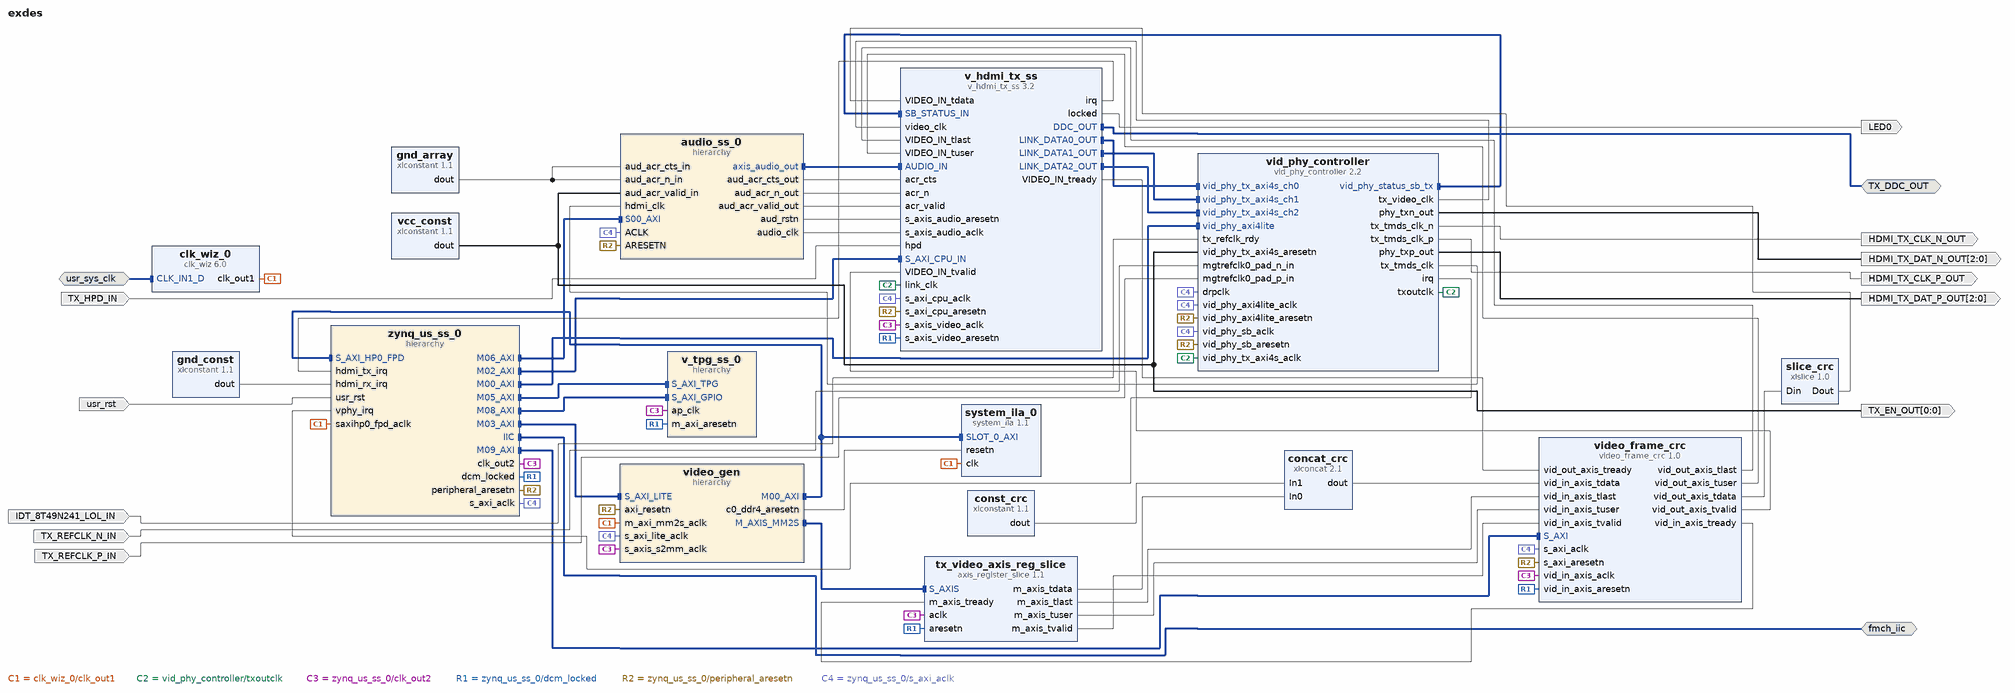
[diagram p0: block diagram of the top level]
# Vivado block design exdes, xczu7ev-ffvc1156-2-e, Vivado 2022.2
create_bd_design exdes

create_bd_intf_port -mode Master -vlnv xilinx.com:interface:iic_rtl:1.0 fmch_iic
create_bd_intf_port -mode Master -vlnv xilinx.com:interface:iic_rtl:1.0 TX_DDC_OUT
create_bd_intf_port -mode Slave -vlnv xilinx.com:interface:diff_clock_rtl:1.0 usr_sys_clk
set_property -dict {CONFIG.FREQ_HZ 300000000} [get_bd_intf_ports usr_sys_clk]
create_bd_port -dir I TX_HPD_IN
create_bd_port -dir I TX_REFCLK_P_IN
create_bd_port -dir I TX_REFCLK_N_IN
create_bd_port -dir O HDMI_TX_CLK_P_OUT
create_bd_port -dir O HDMI_TX_CLK_N_OUT
create_bd_port -dir O -from 2 -to 0 HDMI_TX_DAT_P_OUT
create_bd_port -dir O -from 2 -to 0 HDMI_TX_DAT_N_OUT
create_bd_port -dir O -from 0 -to 0 TX_EN_OUT
create_bd_port -dir I IDT_8T49N241_LOL_IN
create_bd_port -dir O LED0
create_bd_port -dir I -type rst usr_rst
set_property -dict {CONFIG.POLARITY ACTIVE_HIGH} [get_bd_ports usr_rst]

create_bd_cell -type ip -vlnv xilinx.com:ip:vid_phy_controller:2.2 vid_phy_controller
set_property -dict [list \
  CONFIG.CHANNEL_SITE X0Y16 \
  CONFIG.C_INPUT_PIXELS_PER_CLOCK 2 \
  CONFIG.C_INT_HDMI_VER_CMPTBLE 3 \
  CONFIG.C_RX_PLL_SELECTION 0 \
  CONFIG.C_RX_REFCLK_SEL 1 \
  CONFIG.C_Rx_Protocol None \
  CONFIG.C_TX_PLL_SELECTION 6 \
  CONFIG.C_TX_REFCLK_SEL 0 \
  CONFIG.C_Tx_Protocol HDMI \
  CONFIG.C_Txrefclk_Rdy_Invert true \
] [get_bd_cells vid_phy_controller]
create_bd_cell -type ip -vlnv xilinx.com:ip:xlconstant:1.1 vcc_const
set_property -dict {CONFIG.CONST_VAL 1} [get_bd_cells vcc_const]
create_bd_cell -type ip -vlnv xilinx.com:ip:xlconstant:1.1 gnd_const
set_property -dict {CONFIG.CONST_VAL 0} [get_bd_cells gnd_const]
create_bd_cell -type ip -vlnv xilinx.com:ip:axis_register_slice:1.1 tx_video_axis_reg_slice
set_property -dict {CONFIG.HAS_TLAST 1 CONFIG.TUSER_WIDTH 1} [get_bd_cells tx_video_axis_reg_slice]
create_bd_cell -type ip -vlnv xilinx.com:ip:v_hdmi_tx_ss:3.2 v_hdmi_tx_ss
set_property -dict [list \
  CONFIG.C_ADDR_WIDTH 10 \
  CONFIG.C_ADD_MARK_DBG 0 \
  CONFIG.C_EXDES_AXILITE_FREQ 100 \
  CONFIG.C_EXDES_RX_PLL_SELECTION 0 \
  CONFIG.C_EXDES_TOPOLOGY 1 \
  CONFIG.C_EXDES_TX_PLL_SELECTION 6 \
  CONFIG.C_HDMI_FAST_SWITCH true \
  CONFIG.C_HDMI_VERSION 3 \
  CONFIG.C_HPD_INVERT false \
  CONFIG.C_HYSTERESIS_LEVEL 12 \
  CONFIG.C_INCLUDE_HDCP_1_4 false \
  CONFIG.C_INCLUDE_HDCP_2_2 false \
  CONFIG.C_INCLUDE_LOW_RESO_VID true \
  CONFIG.C_INCLUDE_YUV420_SUP true \
  CONFIG.C_INPUT_PIXELS_PER_CLOCK 2 \
  CONFIG.C_MAX_BITS_PER_COMPONENT 8 \
  CONFIG.C_VALIDATION_ENABLE false \
  CONFIG.C_VIDEO_MASK_ENABLE 1 \
  CONFIG.C_VID_INTERFACE 0 \
] [get_bd_cells v_hdmi_tx_ss]
create_bd_cell -type ip -vlnv xilinx.com:ip:xlconstant:1.1 gnd_array
set_property -dict {CONFIG.CONST_VAL 0 CONFIG.CONST_WIDTH 20} [get_bd_cells gnd_array]
create_bd_cell -type ip -vlnv xilinx.com:ip:video_frame_crc:1.0 video_frame_crc
set_property -dict {CONFIG.BPC 8 CONFIG.Pixel_Per_Clock 2} [get_bd_cells video_frame_crc]
create_bd_cell -type ip -vlnv xilinx.com:ip:xlconstant:1.1 const_crc
set_property -dict {CONFIG.CONST_VAL 0 CONFIG.CONST_WIDTH 48} [get_bd_cells const_crc]
create_bd_cell -type ip -vlnv xilinx.com:ip:xlconcat:2.1 concat_crc
create_bd_cell -type ip -vlnv xilinx.com:ip:xlslice:1.0 slice_crc
set_property -dict {CONFIG.DIN_FROM 47 CONFIG.DIN_TO 0 CONFIG.DIN_WIDTH 96} [get_bd_cells slice_crc]
create_bd_cell -type hier v_tpg_ss_0
create_bd_cell -type hier audio_ss_0
create_bd_cell -type hier zynq_us_ss_0
create_bd_cell -type ip -vlnv xilinx.com:ip:system_ila:1.1 system_ila_0
create_bd_cell -type hier video_gen
create_bd_cell -type ip -vlnv xilinx.com:ip:clk_wiz:6.0 clk_wiz_0
set_property -dict [list \
  CONFIG.CLKIN1_JITTER_PS 33.330000000000005 \
  CONFIG.CLKOUT1_JITTER 97.190 \
  CONFIG.CLKOUT1_PHASE_ERROR 87.466 \
  CONFIG.CLKOUT1_REQUESTED_OUT_FREQ 250.000 \
  CONFIG.CLK_IN1_BOARD_INTERFACE clk_300mhz \
  CONFIG.MMCM_CLKFBOUT_MULT_F 11.875 \
  CONFIG.MMCM_CLKIN1_PERIOD 3.333 \
  CONFIG.MMCM_CLKIN2_PERIOD 10.0 \
  CONFIG.MMCM_CLKOUT0_DIVIDE_F 4.750 \
  CONFIG.MMCM_DIVCLK_DIVIDE 3 \
  CONFIG.PRIM_SOURCE Differential_clock_capable_pin \
  CONFIG.USE_LOCKED false \
  CONFIG.USE_RESET false \
] [get_bd_cells clk_wiz_0]

# ---- hierarchy /v_tpg_ss_0 ----
current_bd_instance /v_tpg_ss_0
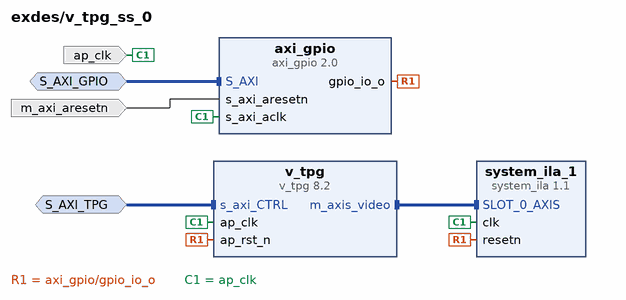
[diagram p1: block diagram inside /v_tpg_ss_0]
create_bd_intf_pin -mode Slave -vlnv xilinx.com:interface:aximm_rtl:1.0 S_AXI_TPG
create_bd_intf_pin -mode Slave -vlnv xilinx.com:interface:aximm_rtl:1.0 S_AXI_GPIO
create_bd_pin -dir I -type clk ap_clk
create_bd_pin -dir I -type rst m_axi_aresetn

create_bd_cell -type ip -vlnv xilinx.com:ip:v_tpg:8.2 v_tpg
set_property -dict [list \
  CONFIG.COLOR_SWEEP 0 \
  CONFIG.DISPLAY_PORT 0 \
  CONFIG.FOREGROUND 0 \
  CONFIG.HAS_AXI4S_SLAVE 0 \
  CONFIG.MAX_DATA_WIDTH 8 \
  CONFIG.RAMP 0 \
  CONFIG.SAMPLES_PER_CLOCK 2 \
  CONFIG.SOLID_COLOR 0 \
  CONFIG.ZONE_PLATE 0 \
] [get_bd_cells v_tpg]
create_bd_cell -type ip -vlnv xilinx.com:ip:axi_gpio:2.0 axi_gpio
set_property -dict {CONFIG.C_ALL_OUTPUTS 1 CONFIG.C_GPIO_WIDTH 1} [get_bd_cells axi_gpio]
create_bd_cell -type ip -vlnv xilinx.com:ip:system_ila:1.1 system_ila_1
set_property -dict {CONFIG.C_SLOT_0_INTF_TYPE xilinx.com:interface:axis_rtl:1.0} [get_bd_cells system_ila_1]

# ---- hierarchy /audio_ss_0 ----
current_bd_instance /audio_ss_0
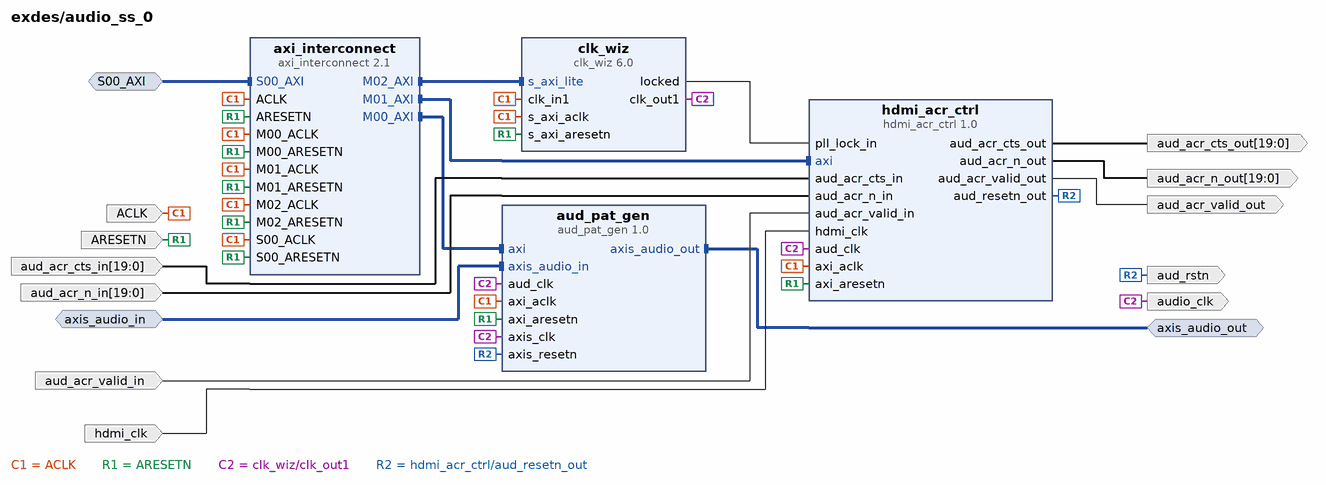
[diagram p2: block diagram inside /audio_ss_0]
create_bd_intf_pin -mode Slave -vlnv xilinx.com:interface:aximm_rtl:1.0 S00_AXI
create_bd_intf_pin -mode Slave -vlnv xilinx.com:interface:axis_rtl:1.0 axis_audio_in
create_bd_intf_pin -mode Master -vlnv xilinx.com:interface:axis_rtl:1.0 axis_audio_out
create_bd_pin -dir I -type clk ACLK
create_bd_pin -dir I -type rst ARESETN
create_bd_pin -dir I -type clk hdmi_clk
create_bd_pin -dir I -from 19 -to 0 aud_acr_cts_in
create_bd_pin -dir I -from 19 -to 0 aud_acr_n_in
create_bd_pin -dir I aud_acr_valid_in
create_bd_pin -dir O -from 19 -to 0 aud_acr_cts_out
create_bd_pin -dir O -from 19 -to 0 aud_acr_n_out
create_bd_pin -dir O aud_acr_valid_out
create_bd_pin -dir O -type rst aud_rstn
create_bd_pin -dir O -type clk audio_clk

create_bd_cell -type ip -vlnv xilinx.com:ip:axi_interconnect:2.1 axi_interconnect
set_property -dict {CONFIG.NUM_MI 3} [get_bd_cells axi_interconnect]
create_bd_cell -type ip -vlnv xilinx.com:ip:clk_wiz:6.0 clk_wiz
set_property -dict {CONFIG.PRIM_SOURCE No_buffer CONFIG.USE_DYN_RECONFIG true} [get_bd_cells clk_wiz]
create_bd_cell -type ip -vlnv xilinx.com:ip:aud_pat_gen:1.0 aud_pat_gen
create_bd_cell -type ip -vlnv xilinx.com:ip:hdmi_acr_ctrl:1.0 hdmi_acr_ctrl
set_property -dict {CONFIG.C_EXDES_TOPOLOGY 1 CONFIG.C_HDMI_VERSION 0} [get_bd_cells hdmi_acr_ctrl]

# ---- hierarchy /zynq_us_ss_0 ----
current_bd_instance /zynq_us_ss_0
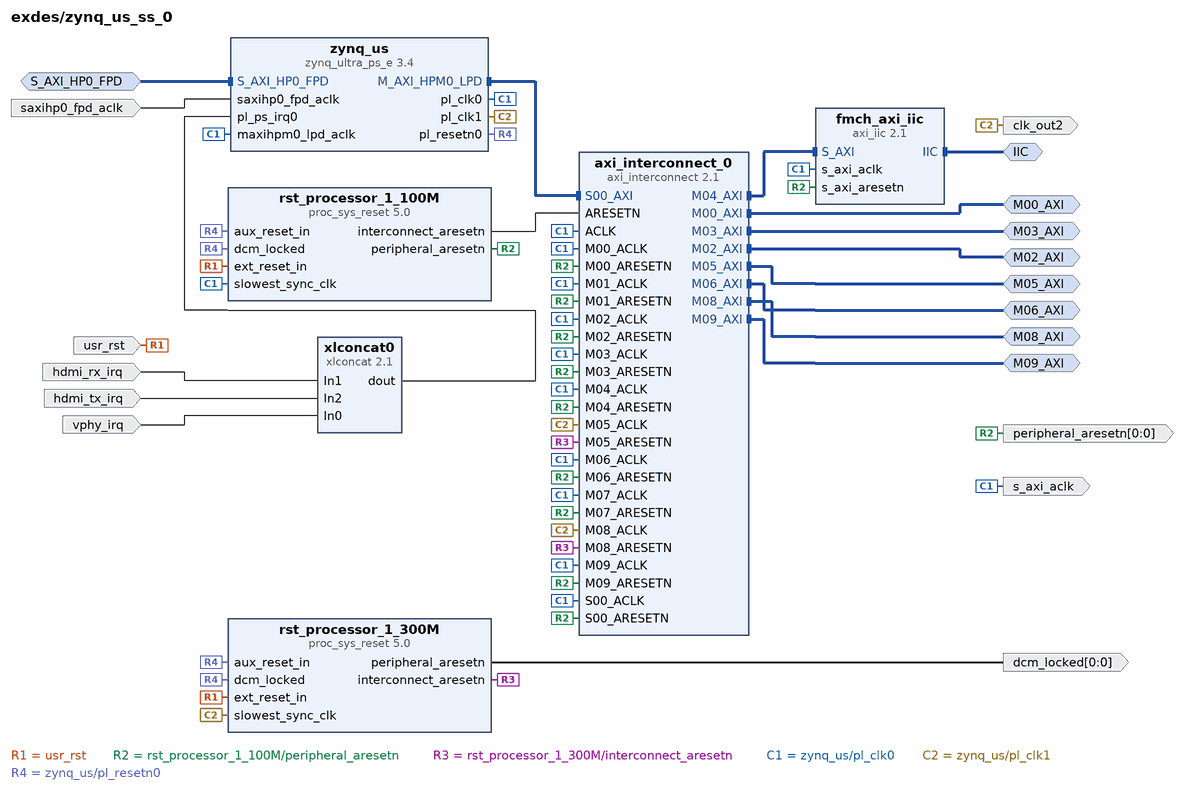
[diagram p3: block diagram inside /zynq_us_ss_0]
create_bd_intf_pin -mode Master -vlnv xilinx.com:interface:iic_rtl:1.0 IIC
create_bd_intf_pin -mode Master -vlnv xilinx.com:interface:aximm_rtl:1.0 M00_AXI
create_bd_intf_pin -mode Master -vlnv xilinx.com:interface:aximm_rtl:1.0 M02_AXI
create_bd_intf_pin -mode Master -vlnv xilinx.com:interface:aximm_rtl:1.0 M05_AXI
create_bd_intf_pin -mode Master -vlnv xilinx.com:interface:aximm_rtl:1.0 M06_AXI
create_bd_intf_pin -mode Master -vlnv xilinx.com:interface:aximm_rtl:1.0 M08_AXI
create_bd_intf_pin -mode Master -vlnv xilinx.com:interface:aximm_rtl:1.0 M09_AXI
create_bd_intf_pin -mode Master -vlnv xilinx.com:interface:aximm_rtl:1.0 M03_AXI
create_bd_intf_pin -mode Slave -vlnv xilinx.com:interface:aximm_rtl:1.0 S_AXI_HP0_FPD
create_bd_pin -dir I hdmi_rx_irq
create_bd_pin -dir I hdmi_tx_irq
create_bd_pin -dir I vphy_irq
create_bd_pin -dir O -type clk clk_out2
create_bd_pin -dir O -from 0 -to 0 dcm_locked
create_bd_pin -dir O -from 0 -to 0 -type rst peripheral_aresetn
create_bd_pin -dir O -type clk s_axi_aclk
create_bd_pin -dir I -type rst usr_rst
create_bd_pin -dir I -type clk saxihp0_fpd_aclk

create_bd_cell -type ip -vlnv xilinx.com:ip:axi_interconnect:2.1 axi_interconnect_0
set_property -dict {CONFIG.NUM_MI 10} [get_bd_cells axi_interconnect_0]
create_bd_cell -type ip -vlnv xilinx.com:ip:xlconcat:2.1 xlconcat0
set_property -dict {CONFIG.NUM_PORTS 3} [get_bd_cells xlconcat0]
create_bd_cell -type ip -vlnv xilinx.com:ip:zynq_ultra_ps_e:3.4 zynq_us
set_property -dict [list \
  CONFIG.PSU_BANK_0_IO_STANDARD LVCMOS18 \
  CONFIG.PSU_BANK_1_IO_STANDARD LVCMOS18 \
  CONFIG.PSU_BANK_2_IO_STANDARD LVCMOS18 \
  CONFIG.PSU_USB3__DUAL_CLOCK_ENABLE 1 \
  CONFIG.PSU__CAN1__PERIPHERAL__ENABLE 1 \
  CONFIG.PSU__CAN1__PERIPHERAL__IO {MIO 24 .. 25} \
  CONFIG.PSU__CRF_APB__ACPU_CTRL__FREQMHZ 1200 \
  CONFIG.PSU__CRF_APB__ACPU_CTRL__SRCSEL APLL \
  CONFIG.PSU__CRF_APB__APLL_CTRL__SRCSEL PSS_REF_CLK \
  CONFIG.PSU__CRF_APB__DBG_FPD_CTRL__FREQMHZ 250 \
  CONFIG.PSU__CRF_APB__DBG_FPD_CTRL__SRCSEL IOPLL \
  CONFIG.PSU__CRF_APB__DBG_TRACE_CTRL__FREQMHZ 250 \
  CONFIG.PSU__CRF_APB__DBG_TRACE_CTRL__SRCSEL IOPLL \
  CONFIG.PSU__CRF_APB__DBG_TSTMP_CTRL__FREQMHZ 250 \
  CONFIG.PSU__CRF_APB__DBG_TSTMP_CTRL__SRCSEL IOPLL \
  CONFIG.PSU__CRF_APB__DDR_CTRL__FREQMHZ 1067 \
  CONFIG.PSU__CRF_APB__DDR_CTRL__SRCSEL DPLL \
  CONFIG.PSU__CRF_APB__DPDMA_REF_CTRL__FREQMHZ 600 \
  CONFIG.PSU__CRF_APB__DPDMA_REF_CTRL__SRCSEL APLL \
  CONFIG.PSU__CRF_APB__DPLL_CTRL__SRCSEL PSS_REF_CLK \
  CONFIG.PSU__CRF_APB__DP_AUDIO_REF_CTRL__SRCSEL RPLL \
  CONFIG.PSU__CRF_APB__DP_STC_REF_CTRL__SRCSEL RPLL \
  CONFIG.PSU__CRF_APB__DP_VIDEO_REF_CTRL__SRCSEL VPLL \
  CONFIG.PSU__CRF_APB__GDMA_REF_CTRL__FREQMHZ 600 \
  CONFIG.PSU__CRF_APB__GDMA_REF_CTRL__SRCSEL APLL \
  CONFIG.PSU__CRF_APB__GPU_REF_CTRL__FREQMHZ 500 \
  CONFIG.PSU__CRF_APB__GPU_REF_CTRL__SRCSEL IOPLL \
  CONFIG.PSU__CRF_APB__TOPSW_LSBUS_CTRL__FREQMHZ 100 \
  CONFIG.PSU__CRF_APB__TOPSW_LSBUS_CTRL__SRCSEL IOPLL \
  CONFIG.PSU__CRF_APB__TOPSW_MAIN_CTRL__FREQMHZ 533.33 \
  CONFIG.PSU__CRF_APB__TOPSW_MAIN_CTRL__SRCSEL DPLL \
  CONFIG.PSU__CRF_APB__VPLL_CTRL__SRCSEL PSS_REF_CLK \
  CONFIG.PSU__CRL_APB__ADMA_REF_CTRL__FREQMHZ 500 \
  CONFIG.PSU__CRL_APB__ADMA_REF_CTRL__SRCSEL IOPLL \
  CONFIG.PSU__CRL_APB__CAN1_REF_CTRL__FREQMHZ 100 \
  CONFIG.PSU__CRL_APB__CAN1_REF_CTRL__SRCSEL IOPLL \
  CONFIG.PSU__CRL_APB__CPU_R5_CTRL__FREQMHZ 500 \
  CONFIG.PSU__CRL_APB__CPU_R5_CTRL__SRCSEL RPLL \
  CONFIG.PSU__CRL_APB__DBG_LPD_CTRL__FREQMHZ 250 \
  CONFIG.PSU__CRL_APB__DBG_LPD_CTRL__SRCSEL IOPLL \
  CONFIG.PSU__CRL_APB__GEM3_REF_CTRL__FREQMHZ 125 \
  CONFIG.PSU__CRL_APB__GEM3_REF_CTRL__SRCSEL IOPLL \
  CONFIG.PSU__CRL_APB__I2C0_REF_CTRL__FREQMHZ 100 \
  CONFIG.PSU__CRL_APB__I2C0_REF_CTRL__SRCSEL IOPLL \
  CONFIG.PSU__CRL_APB__I2C1_REF_CTRL__FREQMHZ 100 \
  CONFIG.PSU__CRL_APB__I2C1_REF_CTRL__SRCSEL IOPLL \
  CONFIG.PSU__CRL_APB__IOPLL_CTRL__SRCSEL PSS_REF_CLK \
  CONFIG.PSU__CRL_APB__IOU_SWITCH_CTRL__FREQMHZ 250 \
  CONFIG.PSU__CRL_APB__IOU_SWITCH_CTRL__SRCSEL IOPLL \
  CONFIG.PSU__CRL_APB__LPD_LSBUS_CTRL__FREQMHZ 100 \
  CONFIG.PSU__CRL_APB__LPD_LSBUS_CTRL__SRCSEL IOPLL \
  CONFIG.PSU__CRL_APB__LPD_SWITCH_CTRL__FREQMHZ 500 \
  CONFIG.PSU__CRL_APB__LPD_SWITCH_CTRL__SRCSEL IOPLL \
  CONFIG.PSU__CRL_APB__PCAP_CTRL__FREQMHZ 200 \
  CONFIG.PSU__CRL_APB__PCAP_CTRL__SRCSEL IOPLL \
  CONFIG.PSU__CRL_APB__PL0_REF_CTRL__FREQMHZ 100 \
  CONFIG.PSU__CRL_APB__PL0_REF_CTRL__SRCSEL RPLL \
  CONFIG.PSU__CRL_APB__PL1_REF_CTRL__FREQMHZ 300 \
  CONFIG.PSU__CRL_APB__QSPI_REF_CTRL__FREQMHZ 125 \
  CONFIG.PSU__CRL_APB__QSPI_REF_CTRL__SRCSEL IOPLL \
  CONFIG.PSU__CRL_APB__RPLL_CTRL__SRCSEL PSS_REF_CLK \
  CONFIG.PSU__CRL_APB__SDIO1_REF_CTRL__FREQMHZ 200 \
  CONFIG.PSU__CRL_APB__SDIO1_REF_CTRL__SRCSEL IOPLL \
  CONFIG.PSU__CRL_APB__TIMESTAMP_REF_CTRL__FREQMHZ 100 \
  CONFIG.PSU__CRL_APB__TIMESTAMP_REF_CTRL__SRCSEL IOPLL \
  CONFIG.PSU__CRL_APB__UART0_REF_CTRL__FREQMHZ 100 \
  CONFIG.PSU__CRL_APB__UART0_REF_CTRL__SRCSEL IOPLL \
  CONFIG.PSU__CRL_APB__UART1_REF_CTRL__FREQMHZ 100 \
  CONFIG.PSU__CRL_APB__UART1_REF_CTRL__SRCSEL IOPLL \
  CONFIG.PSU__CRL_APB__USB0_BUS_REF_CTRL__FREQMHZ 250 \
  CONFIG.PSU__CRL_APB__USB0_BUS_REF_CTRL__SRCSEL IOPLL \
  CONFIG.PSU__CRL_APB__USB3_DUAL_REF_CTRL__FREQMHZ 20 \
  CONFIG.PSU__CRL_APB__USB3_DUAL_REF_CTRL__SRCSEL IOPLL \
  CONFIG.PSU__CRL_APB__USB3__ENABLE 1 \
  CONFIG.PSU__DDRC__BUS_WIDTH {64 Bit} \
  CONFIG.PSU__DDRC__COMPONENTS UDIMM \
  CONFIG.PSU__DDRC__DEVICE_CAPACITY {4096 MBits} \
  CONFIG.PSU__DDRC__DRAM_WIDTH {16 Bits} \
  CONFIG.PSU__DDRC__ECC Disabled \
  CONFIG.PSU__DDRC__MEMORY_TYPE {DDR 4} \
  CONFIG.PSU__DDRC__SPEED_BIN DDR4_2133P \
  CONFIG.PSU__DDR_HIGH_ADDRESS_GUI_ENABLE 0 \
  CONFIG.PSU__DDR__INTERFACE__FREQMHZ 533.500 \
  CONFIG.PSU__DISPLAYPORT__LANE0__ENABLE 1 \
  CONFIG.PSU__DISPLAYPORT__LANE0__IO {GT Lane1} \
  CONFIG.PSU__DISPLAYPORT__LANE1__ENABLE 1 \
  CONFIG.PSU__DISPLAYPORT__LANE1__IO {GT Lane0} \
  CONFIG.PSU__DISPLAYPORT__PERIPHERAL__ENABLE 1 \
  CONFIG.PSU__DLL__ISUSED 1 \
  CONFIG.PSU__DPAUX__PERIPHERAL__ENABLE 1 \
  CONFIG.PSU__DPAUX__PERIPHERAL__IO {MIO 27 .. 30} \
  CONFIG.PSU__DP__LANE_SEL {Dual Lower} \
  CONFIG.PSU__DP__REF_CLK_FREQ 27 \
  CONFIG.PSU__DP__REF_CLK_SEL {Ref Clk3} \
  CONFIG.PSU__ENET3__FIFO__ENABLE 0 \
  CONFIG.PSU__ENET3__GRP_MDIO__ENABLE 1 \
  CONFIG.PSU__ENET3__GRP_MDIO__IO {MIO 76 .. 77} \
  CONFIG.PSU__ENET3__PERIPHERAL__ENABLE 1 \
  CONFIG.PSU__ENET3__PERIPHERAL__IO {MIO 64 .. 75} \
  CONFIG.PSU__ENET3__PTP__ENABLE 0 \
  CONFIG.PSU__ENET3__TSU__ENABLE 0 \
  CONFIG.PSU__FPGA_PL0_ENABLE 1 \
  CONFIG.PSU__FPGA_PL1_ENABLE 1 \
  CONFIG.PSU__GEM3_COHERENCY 0 \
  CONFIG.PSU__GEM3_ROUTE_THROUGH_FPD 0 \
  CONFIG.PSU__GEM__TSU__ENABLE 0 \
  CONFIG.PSU__GPIO0_MIO__IO {MIO 0 .. 25} \
  CONFIG.PSU__GPIO0_MIO__PERIPHERAL__ENABLE 1 \
  CONFIG.PSU__GPIO1_MIO__IO {MIO 26 .. 51} \
  CONFIG.PSU__GPIO1_MIO__PERIPHERAL__ENABLE 1 \
  CONFIG.PSU__GPIO_EMIO_WIDTH 95 \
  CONFIG.PSU__GPIO_EMIO__PERIPHERAL__ENABLE 1 \
  CONFIG.PSU__GPIO_EMIO__PERIPHERAL__IO 95 \
  CONFIG.PSU__GT__LINK_SPEED HBR \
  CONFIG.PSU__GT__PRE_EMPH_LVL_4 0 \
  CONFIG.PSU__GT__VLT_SWNG_LVL_4 0 \
  CONFIG.PSU__I2C0__PERIPHERAL__ENABLE 1 \
  CONFIG.PSU__I2C0__PERIPHERAL__IO {MIO 14 .. 15} \
  CONFIG.PSU__I2C1__PERIPHERAL__ENABLE 1 \
  CONFIG.PSU__I2C1__PERIPHERAL__IO {MIO 16 .. 17} \
  CONFIG.PSU__IOU_SLCR__IOU_TTC_APB_CLK__TTC0_SEL APB \
  CONFIG.PSU__IOU_SLCR__IOU_TTC_APB_CLK__TTC1_SEL APB \
  CONFIG.PSU__IOU_SLCR__IOU_TTC_APB_CLK__TTC2_SEL APB \
  CONFIG.PSU__IOU_SLCR__IOU_TTC_APB_CLK__TTC3_SEL APB \
  CONFIG.PSU__OVERRIDE__BASIC_CLOCK 0 \
  CONFIG.PSU__PRESET_APPLIED 1 \
  CONFIG.PSU__PSS_REF_CLK__FREQMHZ 33.333333 \
  CONFIG.PSU__QSPI_COHERENCY 0 \
  CONFIG.PSU__QSPI_ROUTE_THROUGH_FPD 0 \
  CONFIG.PSU__QSPI__GRP_FBCLK__ENABLE 1 \
  CONFIG.PSU__QSPI__GRP_FBCLK__IO {MIO 6} \
  CONFIG.PSU__QSPI__PERIPHERAL__DATA_MODE x4 \
  CONFIG.PSU__QSPI__PERIPHERAL__ENABLE 1 \
  CONFIG.PSU__QSPI__PERIPHERAL__IO {MIO 0 .. 5} \
  CONFIG.PSU__QSPI__PERIPHERAL__MODE Single \
  CONFIG.PSU__SATA__LANE1__IO {GT Lane3} \
  CONFIG.PSU__SATA__PERIPHERAL__ENABLE 1 \
  CONFIG.PSU__SATA__REF_CLK_FREQ 125 \
  CONFIG.PSU__SATA__REF_CLK_SEL {Ref Clk1} \
  CONFIG.PSU__SAXIGP2__DATA_WIDTH 64 \
  CONFIG.PSU__SD1_COHERENCY 0 \
  CONFIG.PSU__SD1_ROUTE_THROUGH_FPD 0 \
  CONFIG.PSU__SD1__CLK_50_SDR_ITAP_DLY 0x15 \
  CONFIG.PSU__SD1__CLK_50_SDR_OTAP_DLY 0x5 \
  CONFIG.PSU__SD1__DATA_TRANSFER_MODE 4Bit \
  CONFIG.PSU__SD1__GRP_CD__ENABLE 1 \
  CONFIG.PSU__SD1__GRP_CD__IO {MIO 45} \
  CONFIG.PSU__SD1__GRP_POW__ENABLE 0 \
  CONFIG.PSU__SD1__GRP_WP__ENABLE 0 \
  CONFIG.PSU__SD1__PERIPHERAL__ENABLE 1 \
  CONFIG.PSU__SD1__PERIPHERAL__IO {MIO 46 .. 51} \
  CONFIG.PSU__SD1__SLOT_TYPE {SD 2.0} \
  CONFIG.PSU__SWDT0__CLOCK__ENABLE 0 \
  CONFIG.PSU__SWDT0__PERIPHERAL__ENABLE 1 \
  CONFIG.PSU__SWDT0__RESET__ENABLE 0 \
  CONFIG.PSU__SWDT1__CLOCK__ENABLE 0 \
  CONFIG.PSU__SWDT1__PERIPHERAL__ENABLE 1 \
  CONFIG.PSU__SWDT1__RESET__ENABLE 0 \
  CONFIG.PSU__TSU__BUFG_PORT_PAIR 0 \
  CONFIG.PSU__TTC0__CLOCK__ENABLE 0 \
  CONFIG.PSU__TTC0__PERIPHERAL__ENABLE 1 \
  CONFIG.PSU__TTC0__WAVEOUT__ENABLE 0 \
  CONFIG.PSU__TTC1__CLOCK__ENABLE 0 \
  CONFIG.PSU__TTC1__PERIPHERAL__ENABLE 1 \
  CONFIG.PSU__TTC1__WAVEOUT__ENABLE 0 \
  CONFIG.PSU__TTC2__CLOCK__ENABLE 0 \
  CONFIG.PSU__TTC2__PERIPHERAL__ENABLE 1 \
  CONFIG.PSU__TTC2__WAVEOUT__ENABLE 0 \
  CONFIG.PSU__TTC3__CLOCK__ENABLE 0 \
  CONFIG.PSU__TTC3__PERIPHERAL__ENABLE 1 \
  CONFIG.PSU__TTC3__WAVEOUT__ENABLE 0 \
  CONFIG.PSU__UART0__BAUD_RATE 115200 \
  CONFIG.PSU__UART0__MODEM__ENABLE 0 \
  CONFIG.PSU__UART0__PERIPHERAL__ENABLE 1 \
  CONFIG.PSU__UART0__PERIPHERAL__IO {MIO 18 .. 19} \
  CONFIG.PSU__UART1__BAUD_RATE 115200 \
  CONFIG.PSU__UART1__MODEM__ENABLE 0 \
  CONFIG.PSU__UART1__PERIPHERAL__ENABLE 1 \
  CONFIG.PSU__UART1__PERIPHERAL__IO {MIO 20 .. 21} \
  CONFIG.PSU__USB0_COHERENCY 0 \
  CONFIG.PSU__USB0__PERIPHERAL__ENABLE 1 \
  CONFIG.PSU__USB0__PERIPHERAL__IO {MIO 52 .. 63} \
  CONFIG.PSU__USB0__REF_CLK_FREQ 26 \
  CONFIG.PSU__USB0__REF_CLK_SEL {Ref Clk2} \
  CONFIG.PSU__USB2_0__EMIO__ENABLE 0 \
  CONFIG.PSU__USB3_0__EMIO__ENABLE 0 \
  CONFIG.PSU__USB3_0__PERIPHERAL__ENABLE 1 \
  CONFIG.PSU__USB3_0__PERIPHERAL__IO {GT Lane2} \
  CONFIG.PSU__USB__RESET__MODE {Boot Pin} \
  CONFIG.PSU__USB__RESET__POLARITY {Active Low} \
  CONFIG.PSU__USE__IRQ0 1 \
  CONFIG.PSU__USE__IRQ1 1 \
  CONFIG.PSU__USE__M_AXI_GP0 0 \
  CONFIG.PSU__USE__M_AXI_GP1 0 \
  CONFIG.PSU__USE__M_AXI_GP2 1 \
  CONFIG.PSU__USE__S_AXI_GP2 1 \
] [get_bd_cells zynq_us]
# 116 more settings of zynq_us are not shown: defaults, MIO pin electricals, DDR timing, and values the tool derives
create_bd_cell -type ip -vlnv xilinx.com:ip:axi_iic:2.1 fmch_axi_iic
set_property -dict {CONFIG.IIC_BOARD_INTERFACE Custom CONFIG.USE_BOARD_FLOW true} [get_bd_cells fmch_axi_iic]
create_bd_cell -type ip -vlnv xilinx.com:ip:proc_sys_reset:5.0 rst_processor_1_100M
set_property -dict {CONFIG.RESET_BOARD_INTERFACE reset CONFIG.USE_BOARD_FLOW true} [get_bd_cells rst_processor_1_100M]
create_bd_cell -type ip -vlnv xilinx.com:ip:proc_sys_reset:5.0 rst_processor_1_300M
set_property -dict {CONFIG.RESET_BOARD_INTERFACE reset CONFIG.USE_BOARD_FLOW true} [get_bd_cells rst_processor_1_300M]

# ---- hierarchy /video_gen ----
current_bd_instance /video_gen
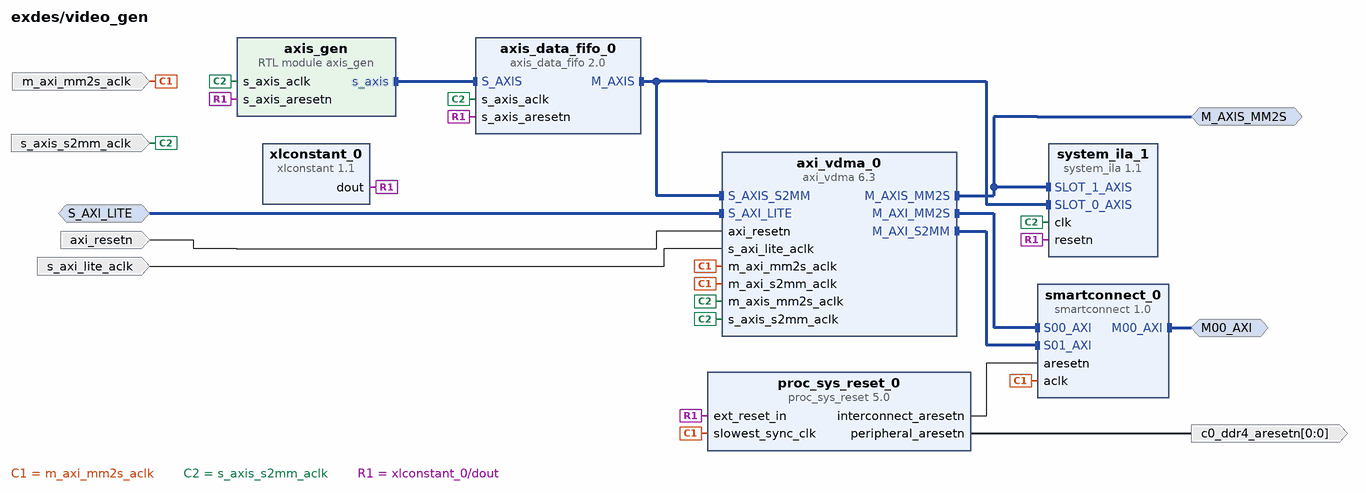
[diagram p4: block diagram inside /video_gen]
create_bd_intf_pin -mode Slave -vlnv xilinx.com:interface:aximm_rtl:1.0 S_AXI_LITE
create_bd_intf_pin -mode Master -vlnv xilinx.com:interface:axis_rtl:1.0 M_AXIS_MM2S
create_bd_intf_pin -mode Master -vlnv xilinx.com:interface:aximm_rtl:1.0 M00_AXI
create_bd_pin -dir I -type clk s_axi_lite_aclk
create_bd_pin -dir I -type clk s_axis_s2mm_aclk
create_bd_pin -dir I -type rst axi_resetn
create_bd_pin -dir O -from 0 -to 0 -type rst c0_ddr4_aresetn
create_bd_pin -dir I -type clk m_axi_mm2s_aclk

create_bd_cell -type ip -vlnv xilinx.com:ip:smartconnect:1.0 smartconnect_0
create_bd_cell -type ip -vlnv xilinx.com:ip:axi_vdma:6.3 axi_vdma_0
set_property -dict [list \
  CONFIG.c_m_axis_mm2s_tdata_width 48 \
  CONFIG.c_mm2s_genlock_mode 1 \
  CONFIG.c_s2mm_genlock_mode 0 \
  CONFIG.c_use_s2mm_fsync 0 \
] [get_bd_cells axi_vdma_0]
create_bd_cell -type ip -vlnv xilinx.com:ip:xlconstant:1.1 xlconstant_0
create_bd_cell -type ip -vlnv xilinx.com:ip:proc_sys_reset:5.0 proc_sys_reset_0
create_bd_cell -type ip -vlnv xilinx.com:ip:system_ila:1.1 system_ila_1
set_property -dict [list \
  CONFIG.C_NUM_MONITOR_SLOTS 2 \
  CONFIG.C_SLOT 1 \
  CONFIG.C_SLOT_0_INTF_TYPE xilinx.com:interface:axis_rtl:1.0 \
  CONFIG.C_SLOT_1_INTF_TYPE xilinx.com:interface:axis_rtl:1.0 \
] [get_bd_cells system_ila_1]
create_bd_cell -type ip -vlnv xilinx.com:ip:axis_data_fifo:2.0 axis_data_fifo_0
create_bd_cell -type module -reference axis_gen axis_gen

# ---- connections ----

current_bd_instance /v_tpg_ss_0
connect_bd_intf_net [get_bd_intf_pins S_AXI_GPIO] [get_bd_intf_pins axi_gpio/S_AXI]
connect_bd_intf_net [get_bd_intf_pins S_AXI_TPG] [get_bd_intf_pins v_tpg/s_axi_CTRL]
connect_bd_intf_net [get_bd_intf_pins v_tpg/m_axis_video] [get_bd_intf_pins system_ila_1/SLOT_0_AXIS]
connect_bd_net -net net_axi_gpio_gpio_io_o [get_bd_pins axi_gpio/gpio_io_o] [get_bd_pins v_tpg/ap_rst_n] [get_bd_pins system_ila_1/resetn]
connect_bd_net -net net_bdry_in_ap_clk [get_bd_pins ap_clk] \
  [get_bd_pins axi_gpio/s_axi_aclk] [get_bd_pins v_tpg/ap_clk] [get_bd_pins system_ila_1/clk]
connect_bd_net -net net_bdry_in_m_axi_aresetn [get_bd_pins m_axi_aresetn] [get_bd_pins axi_gpio/s_axi_aresetn]

current_bd_instance /audio_ss_0
connect_bd_intf_net [get_bd_intf_pins axis_audio_out] [get_bd_intf_pins aud_pat_gen/axis_audio_out]
connect_bd_intf_net [get_bd_intf_pins axi_interconnect/M00_AXI] [get_bd_intf_pins aud_pat_gen/axi]
connect_bd_intf_net [get_bd_intf_pins axi_interconnect/M01_AXI] [get_bd_intf_pins hdmi_acr_ctrl/axi]
connect_bd_intf_net [get_bd_intf_pins axi_interconnect/M02_AXI] [get_bd_intf_pins clk_wiz/s_axi_lite]
connect_bd_intf_net [get_bd_intf_pins S00_AXI] [get_bd_intf_pins axi_interconnect/S00_AXI]
connect_bd_intf_net [get_bd_intf_pins axis_audio_in] [get_bd_intf_pins aud_pat_gen/axis_audio_in]
connect_bd_net -net net_bdry_in_ACLK [get_bd_pins ACLK] \
  [get_bd_pins axi_interconnect/ACLK] [get_bd_pins aud_pat_gen/axi_aclk] [get_bd_pins hdmi_acr_ctrl/axi_aclk] \
  [get_bd_pins clk_wiz/s_axi_aclk] [get_bd_pins clk_wiz/clk_in1] [get_bd_pins axi_interconnect/S00_ACLK] \
  [get_bd_pins axi_interconnect/M00_ACLK] [get_bd_pins axi_interconnect/M01_ACLK] [get_bd_pins axi_interconnect/M02_ACLK]
connect_bd_net -net net_bdry_in_ARESETN [get_bd_pins ARESETN] \
  [get_bd_pins axi_interconnect/ARESETN] [get_bd_pins aud_pat_gen/axi_aresetn] [get_bd_pins hdmi_acr_ctrl/axi_aresetn] \
  [get_bd_pins clk_wiz/s_axi_aresetn] [get_bd_pins axi_interconnect/S00_ARESETN] [get_bd_pins axi_interconnect/M00_ARESETN] \
  [get_bd_pins axi_interconnect/M01_ARESETN] [get_bd_pins axi_interconnect/M02_ARESETN]
connect_bd_net -net net_bdry_in_aud_acr_cts_in [get_bd_pins aud_acr_cts_in] [get_bd_pins hdmi_acr_ctrl/aud_acr_cts_in]
connect_bd_net -net net_bdry_in_aud_acr_n_in [get_bd_pins aud_acr_n_in] [get_bd_pins hdmi_acr_ctrl/aud_acr_n_in]
connect_bd_net -net net_bdry_in_aud_acr_valid_in [get_bd_pins aud_acr_valid_in] [get_bd_pins hdmi_acr_ctrl/aud_acr_valid_in]
connect_bd_net -net net_bdry_in_hdmi_clk [get_bd_pins hdmi_clk] [get_bd_pins hdmi_acr_ctrl/hdmi_clk]
connect_bd_net -net net_clk_wiz_clk_out1 [get_bd_pins clk_wiz/clk_out1] \
  [get_bd_pins audio_clk] [get_bd_pins aud_pat_gen/axis_clk] [get_bd_pins aud_pat_gen/aud_clk] \
  [get_bd_pins hdmi_acr_ctrl/aud_clk]
connect_bd_net -net net_clk_wiz_locked [get_bd_pins clk_wiz/locked] [get_bd_pins hdmi_acr_ctrl/pll_lock_in]
connect_bd_net -net net_hdmi_acr_ctrl_aud_acr_cts_out [get_bd_pins hdmi_acr_ctrl/aud_acr_cts_out] [get_bd_pins aud_acr_cts_out]
connect_bd_net -net net_hdmi_acr_ctrl_aud_acr_n_out [get_bd_pins hdmi_acr_ctrl/aud_acr_n_out] [get_bd_pins aud_acr_n_out]
connect_bd_net -net net_hdmi_acr_ctrl_aud_acr_valid_out [get_bd_pins hdmi_acr_ctrl/aud_acr_valid_out] [get_bd_pins aud_acr_valid_out]
connect_bd_net -net net_hdmi_acr_ctrl_aud_resetn_out [get_bd_pins hdmi_acr_ctrl/aud_resetn_out] \
  [get_bd_pins aud_rstn] [get_bd_pins aud_pat_gen/axis_resetn]

current_bd_instance /zynq_us_ss_0
connect_bd_intf_net [get_bd_intf_pins M03_AXI] [get_bd_intf_pins axi_interconnect_0/M03_AXI]
connect_bd_intf_net [get_bd_intf_pins S_AXI_HP0_FPD] [get_bd_intf_pins zynq_us/S_AXI_HP0_FPD]
connect_bd_intf_net [get_bd_intf_pins M00_AXI] [get_bd_intf_pins axi_interconnect_0/M00_AXI]
connect_bd_intf_net [get_bd_intf_pins M02_AXI] [get_bd_intf_pins axi_interconnect_0/M02_AXI]
connect_bd_intf_net [get_bd_intf_pins axi_interconnect_0/M04_AXI] [get_bd_intf_pins fmch_axi_iic/S_AXI]
connect_bd_intf_net [get_bd_intf_pins M05_AXI] [get_bd_intf_pins axi_interconnect_0/M05_AXI]
connect_bd_intf_net [get_bd_intf_pins M06_AXI] [get_bd_intf_pins axi_interconnect_0/M06_AXI]
connect_bd_intf_net [get_bd_intf_pins M08_AXI] [get_bd_intf_pins axi_interconnect_0/M08_AXI]
connect_bd_intf_net [get_bd_intf_pins M09_AXI] [get_bd_intf_pins axi_interconnect_0/M09_AXI]
connect_bd_intf_net [get_bd_intf_pins IIC] [get_bd_intf_pins fmch_axi_iic/IIC]
connect_bd_intf_net [get_bd_intf_pins zynq_us/M_AXI_HPM0_LPD] [get_bd_intf_pins axi_interconnect_0/S00_AXI]
connect_bd_net -net net_bdry_in_ext_reset_in [get_bd_pins usr_rst] \
  [get_bd_pins rst_processor_1_100M/ext_reset_in] [get_bd_pins rst_processor_1_300M/ext_reset_in]
connect_bd_net -net net_bdry_in_hdmi_rx_irq [get_bd_pins hdmi_rx_irq] [get_bd_pins xlconcat0/In1]
connect_bd_net -net net_bdry_in_hdmi_tx_irq [get_bd_pins hdmi_tx_irq] [get_bd_pins xlconcat0/In2]
connect_bd_net -net net_bdry_in_vphy_irq [get_bd_pins vphy_irq] [get_bd_pins xlconcat0/In0]
connect_bd_net -net net_rst_processor_1_100M_interconnect_aresetn [get_bd_pins rst_processor_1_100M/interconnect_aresetn] \
  [get_bd_pins axi_interconnect_0/ARESETN]
connect_bd_net -net net_rst_processor_1_100M_peripheral_aresetn [get_bd_pins rst_processor_1_100M/peripheral_aresetn] \
  [get_bd_pins fmch_axi_iic/s_axi_aresetn] [get_bd_pins axi_interconnect_0/S00_ARESETN] [get_bd_pins peripheral_aresetn] \
  [get_bd_pins axi_interconnect_0/M00_ARESETN] [get_bd_pins axi_interconnect_0/M01_ARESETN] \
  [get_bd_pins axi_interconnect_0/M02_ARESETN] [get_bd_pins axi_interconnect_0/M03_ARESETN] \
  [get_bd_pins axi_interconnect_0/M04_ARESETN] [get_bd_pins axi_interconnect_0/M06_ARESETN] \
  [get_bd_pins axi_interconnect_0/M07_ARESETN] [get_bd_pins axi_interconnect_0/M09_ARESETN]
connect_bd_net -net net_rst_processor_1_300M_interconnect_aresetn [get_bd_pins rst_processor_1_300M/interconnect_aresetn] \
  [get_bd_pins axi_interconnect_0/M05_ARESETN] [get_bd_pins axi_interconnect_0/M08_ARESETN]
connect_bd_net -net net_rst_processor_1_300M_peripheral_aresetn [get_bd_pins rst_processor_1_300M/peripheral_aresetn] [get_bd_pins dcm_locked]
connect_bd_net -net net_xlconcat0_dout [get_bd_pins xlconcat0/dout] [get_bd_pins zynq_us/pl_ps_irq0]
connect_bd_net -net net_zynq_us_pl_clk0 [get_bd_pins zynq_us/pl_clk0] \
  [get_bd_pins rst_processor_1_100M/slowest_sync_clk] [get_bd_pins zynq_us/maxihpm0_lpd_aclk] \
  [get_bd_pins fmch_axi_iic/s_axi_aclk] [get_bd_pins axi_interconnect_0/S00_ACLK] [get_bd_pins s_axi_aclk] \
  [get_bd_pins axi_interconnect_0/ACLK] [get_bd_pins axi_interconnect_0/M00_ACLK] [get_bd_pins axi_interconnect_0/M01_ACLK] \
  [get_bd_pins axi_interconnect_0/M02_ACLK] [get_bd_pins axi_interconnect_0/M03_ACLK] \
  [get_bd_pins axi_interconnect_0/M04_ACLK] [get_bd_pins axi_interconnect_0/M06_ACLK] \
  [get_bd_pins axi_interconnect_0/M07_ACLK] [get_bd_pins axi_interconnect_0/M09_ACLK]
connect_bd_net -net net_zynq_us_pl_clk1 [get_bd_pins zynq_us/pl_clk1] \
  [get_bd_pins rst_processor_1_300M/slowest_sync_clk] [get_bd_pins axi_interconnect_0/M05_ACLK] \
  [get_bd_pins axi_interconnect_0/M08_ACLK] [get_bd_pins clk_out2]
connect_bd_net -net net_zynq_us_pl_resetn0 [get_bd_pins zynq_us/pl_resetn0] \
  [get_bd_pins rst_processor_1_100M/aux_reset_in] [get_bd_pins rst_processor_1_100M/dcm_locked] \
  [get_bd_pins rst_processor_1_300M/aux_reset_in] [get_bd_pins rst_processor_1_300M/dcm_locked]
connect_bd_net [get_bd_pins saxihp0_fpd_aclk] [get_bd_pins zynq_us/saxihp0_fpd_aclk]

current_bd_instance /video_gen
connect_bd_intf_net [get_bd_intf_pins M_AXIS_MM2S] [get_bd_intf_pins axi_vdma_0/M_AXIS_MM2S]
connect_bd_intf_net [get_bd_intf_pins M_AXIS_MM2S] [get_bd_intf_pins system_ila_1/SLOT_1_AXIS]
connect_bd_intf_net [get_bd_intf_pins axi_vdma_0/M_AXI_MM2S] [get_bd_intf_pins smartconnect_0/S00_AXI]
connect_bd_intf_net [get_bd_intf_pins axi_vdma_0/M_AXI_S2MM] [get_bd_intf_pins smartconnect_0/S01_AXI]
connect_bd_intf_net [get_bd_intf_pins axis_data_fifo_0/M_AXIS] [get_bd_intf_pins axi_vdma_0/S_AXIS_S2MM]
connect_bd_intf_net [get_bd_intf_pins axis_data_fifo_0/M_AXIS] [get_bd_intf_pins system_ila_1/SLOT_0_AXIS]
connect_bd_intf_net [get_bd_intf_pins axis_gen/s_axis] [get_bd_intf_pins axis_data_fifo_0/S_AXIS]
connect_bd_intf_net [get_bd_intf_pins M00_AXI] [get_bd_intf_pins smartconnect_0/M00_AXI]
connect_bd_intf_net [get_bd_intf_pins S_AXI_LITE] [get_bd_intf_pins axi_vdma_0/S_AXI_LITE]
connect_bd_net -net ddr4_0_c0_ddr4_ui_clk [get_bd_pins m_axi_mm2s_aclk] \
  [get_bd_pins axi_vdma_0/m_axi_s2mm_aclk] [get_bd_pins axi_vdma_0/m_axi_mm2s_aclk] \
  [get_bd_pins proc_sys_reset_0/slowest_sync_clk] [get_bd_pins smartconnect_0/aclk]
connect_bd_net -net net_zynq_us_ss_0_clk_out2 [get_bd_pins s_axis_s2mm_aclk] \
  [get_bd_pins axi_vdma_0/s_axis_s2mm_aclk] [get_bd_pins axi_vdma_0/m_axis_mm2s_aclk] [get_bd_pins system_ila_1/clk] \
  [get_bd_pins axis_data_fifo_0/s_axis_aclk] [get_bd_pins axis_gen/s_axis_aclk]
connect_bd_net -net net_zynq_us_ss_0_peripheral_aresetn [get_bd_pins axi_resetn] [get_bd_pins axi_vdma_0/axi_resetn]
connect_bd_net -net net_zynq_us_ss_0_s_axi_aclk [get_bd_pins s_axi_lite_aclk] [get_bd_pins axi_vdma_0/s_axi_lite_aclk]
connect_bd_net [get_bd_pins proc_sys_reset_0/interconnect_aresetn] [get_bd_pins smartconnect_0/aresetn]
connect_bd_net [get_bd_pins proc_sys_reset_0/peripheral_aresetn] [get_bd_pins c0_ddr4_aresetn]
connect_bd_net [get_bd_pins xlconstant_0/dout] \
  [get_bd_pins proc_sys_reset_0/ext_reset_in] [get_bd_pins system_ila_1/resetn] [get_bd_pins axis_data_fifo_0/s_axis_aresetn] \
  [get_bd_pins axis_gen/s_axis_aresetn]

current_bd_instance /
connect_bd_intf_net [get_bd_intf_pins zynq_us_ss_0/S_AXI_HP0_FPD] [get_bd_intf_pins video_gen/M00_AXI]
connect_bd_intf_net [get_bd_intf_pins zynq_us_ss_0/S_AXI_HP0_FPD] [get_bd_intf_pins system_ila_0/SLOT_0_AXI]
connect_bd_intf_net [get_bd_intf_pins video_gen/M_AXIS_MM2S] [get_bd_intf_pins tx_video_axis_reg_slice/S_AXIS]
connect_bd_intf_net [get_bd_intf_pins audio_ss_0/axis_audio_out] [get_bd_intf_pins v_hdmi_tx_ss/AUDIO_IN]
connect_bd_intf_net [get_bd_intf_ports TX_DDC_OUT] [get_bd_intf_pins v_hdmi_tx_ss/DDC_OUT]
connect_bd_intf_net [get_bd_intf_pins v_hdmi_tx_ss/LINK_DATA0_OUT] [get_bd_intf_pins vid_phy_controller/vid_phy_tx_axi4s_ch0]
connect_bd_intf_net [get_bd_intf_pins v_hdmi_tx_ss/LINK_DATA1_OUT] [get_bd_intf_pins vid_phy_controller/vid_phy_tx_axi4s_ch1]
connect_bd_intf_net [get_bd_intf_pins v_hdmi_tx_ss/LINK_DATA2_OUT] [get_bd_intf_pins vid_phy_controller/vid_phy_tx_axi4s_ch2]
connect_bd_intf_net [get_bd_intf_pins vid_phy_controller/vid_phy_status_sb_tx] [get_bd_intf_pins v_hdmi_tx_ss/SB_STATUS_IN]
connect_bd_intf_net [get_bd_intf_ports fmch_iic] [get_bd_intf_pins zynq_us_ss_0/IIC]
connect_bd_intf_net [get_bd_intf_pins zynq_us_ss_0/M00_AXI] [get_bd_intf_pins vid_phy_controller/vid_phy_axi4lite]
connect_bd_intf_net [get_bd_intf_pins zynq_us_ss_0/M02_AXI] [get_bd_intf_pins v_hdmi_tx_ss/S_AXI_CPU_IN]
connect_bd_intf_net [get_bd_intf_pins zynq_us_ss_0/M05_AXI] [get_bd_intf_pins v_tpg_ss_0/S_AXI_TPG]
connect_bd_intf_net [get_bd_intf_pins zynq_us_ss_0/M06_AXI] [get_bd_intf_pins audio_ss_0/S00_AXI]
connect_bd_intf_net [get_bd_intf_pins zynq_us_ss_0/M08_AXI] [get_bd_intf_pins v_tpg_ss_0/S_AXI_GPIO]
connect_bd_intf_net [get_bd_intf_pins zynq_us_ss_0/M09_AXI] [get_bd_intf_pins video_frame_crc/S_AXI]
connect_bd_intf_net [get_bd_intf_ports usr_sys_clk] [get_bd_intf_pins clk_wiz_0/CLK_IN1_D]
connect_bd_intf_net [get_bd_intf_pins video_gen/S_AXI_LITE] [get_bd_intf_pins zynq_us_ss_0/M03_AXI]
connect_bd_net [get_bd_pins clk_wiz_0/clk_out1] \
  [get_bd_pins zynq_us_ss_0/saxihp0_fpd_aclk] [get_bd_pins video_gen/m_axi_mm2s_aclk] [get_bd_pins system_ila_0/clk]
connect_bd_net -net net_audio_ss_0_aud_acr_cts_out [get_bd_pins audio_ss_0/aud_acr_cts_out] [get_bd_pins v_hdmi_tx_ss/acr_cts]
connect_bd_net -net net_audio_ss_0_aud_acr_n_out [get_bd_pins audio_ss_0/aud_acr_n_out] [get_bd_pins v_hdmi_tx_ss/acr_n]
connect_bd_net -net net_audio_ss_0_aud_acr_valid_out [get_bd_pins audio_ss_0/aud_acr_valid_out] [get_bd_pins v_hdmi_tx_ss/acr_valid]
connect_bd_net -net net_audio_ss_0_aud_rstn [get_bd_pins audio_ss_0/aud_rstn] [get_bd_pins v_hdmi_tx_ss/s_axis_audio_aresetn]
connect_bd_net -net net_audio_ss_0_audio_clk [get_bd_pins audio_ss_0/audio_clk] [get_bd_pins v_hdmi_tx_ss/s_axis_audio_aclk]
connect_bd_net -net net_bdry_in_IDT_8T49N241_LOL_IN [get_bd_ports IDT_8T49N241_LOL_IN] [get_bd_pins vid_phy_controller/tx_refclk_rdy]
connect_bd_net -net net_bdry_in_TX_HPD_IN [get_bd_ports TX_HPD_IN] [get_bd_pins v_hdmi_tx_ss/hpd]
connect_bd_net -net net_bdry_in_TX_REFCLK_N_IN [get_bd_ports TX_REFCLK_N_IN] [get_bd_pins vid_phy_controller/mgtrefclk0_pad_n_in]
connect_bd_net -net net_bdry_in_TX_REFCLK_P_IN [get_bd_ports TX_REFCLK_P_IN] [get_bd_pins vid_phy_controller/mgtrefclk0_pad_p_in]
connect_bd_net -net net_concat_crc_dout [get_bd_pins concat_crc/dout] [get_bd_pins video_frame_crc/vid_in_axis_tdata]
connect_bd_net -net net_const_crc_dout [get_bd_pins const_crc/dout] [get_bd_pins concat_crc/In1]
connect_bd_net -net net_gnd_array_dout [get_bd_pins gnd_array/dout] [get_bd_pins audio_ss_0/aud_acr_cts_in] [get_bd_pins audio_ss_0/aud_acr_n_in]
connect_bd_net -net net_gnd_const_dout [get_bd_pins gnd_const/dout] [get_bd_pins zynq_us_ss_0/hdmi_rx_irq]
connect_bd_net -net net_slice_crc_Dout [get_bd_pins slice_crc/Dout] [get_bd_pins v_hdmi_tx_ss/VIDEO_IN_tdata]
connect_bd_net -net net_tx_video_axis_reg_slice_m_axis_tdata [get_bd_pins tx_video_axis_reg_slice/m_axis_tdata] [get_bd_pins concat_crc/In0]
connect_bd_net -net net_tx_video_axis_reg_slice_m_axis_tlast [get_bd_pins tx_video_axis_reg_slice/m_axis_tlast] \
  [get_bd_pins video_frame_crc/vid_in_axis_tlast]
connect_bd_net -net net_tx_video_axis_reg_slice_m_axis_tready [get_bd_pins video_frame_crc/vid_in_axis_tready] \
  [get_bd_pins tx_video_axis_reg_slice/m_axis_tready]
connect_bd_net -net net_tx_video_axis_reg_slice_m_axis_tuser [get_bd_pins tx_video_axis_reg_slice/m_axis_tuser] \
  [get_bd_pins video_frame_crc/vid_in_axis_tuser]
connect_bd_net -net net_tx_video_axis_reg_slice_m_axis_tvalid [get_bd_pins tx_video_axis_reg_slice/m_axis_tvalid] \
  [get_bd_pins video_frame_crc/vid_in_axis_tvalid]
connect_bd_net -net net_v_hdmi_tx_ss_irq [get_bd_pins v_hdmi_tx_ss/irq] [get_bd_pins zynq_us_ss_0/hdmi_tx_irq]
connect_bd_net -net net_v_hdmi_tx_ss_locked [get_bd_pins v_hdmi_tx_ss/locked] [get_bd_ports LED0]
connect_bd_net -net net_vcc_const_dout [get_bd_pins vcc_const/dout] \
  [get_bd_ports TX_EN_OUT] [get_bd_pins vid_phy_controller/vid_phy_tx_axi4s_aresetn] \
  [get_bd_pins audio_ss_0/aud_acr_valid_in]
connect_bd_net -net net_vid_phy_controller_irq [get_bd_pins vid_phy_controller/irq] [get_bd_pins zynq_us_ss_0/vphy_irq]
connect_bd_net -net net_vid_phy_controller_phy_txn_out [get_bd_pins vid_phy_controller/phy_txn_out] [get_bd_ports HDMI_TX_DAT_N_OUT]
connect_bd_net -net net_vid_phy_controller_phy_txp_out [get_bd_pins vid_phy_controller/phy_txp_out] [get_bd_ports HDMI_TX_DAT_P_OUT]
connect_bd_net -net net_vid_phy_controller_tx_tmds_clk [get_bd_pins vid_phy_controller/tx_tmds_clk] [get_bd_pins audio_ss_0/hdmi_clk]
connect_bd_net -net net_vid_phy_controller_tx_tmds_clk_n [get_bd_pins vid_phy_controller/tx_tmds_clk_n] [get_bd_ports HDMI_TX_CLK_N_OUT]
connect_bd_net -net net_vid_phy_controller_tx_tmds_clk_p [get_bd_pins vid_phy_controller/tx_tmds_clk_p] [get_bd_ports HDMI_TX_CLK_P_OUT]
connect_bd_net -net net_vid_phy_controller_tx_video_clk [get_bd_pins vid_phy_controller/tx_video_clk] [get_bd_pins v_hdmi_tx_ss/video_clk]
connect_bd_net -net net_vid_phy_controller_txoutclk [get_bd_pins vid_phy_controller/txoutclk] \
  [get_bd_pins vid_phy_controller/vid_phy_tx_axi4s_aclk] [get_bd_pins v_hdmi_tx_ss/link_clk]
connect_bd_net -net net_video_frame_crc_vid_out_axis_tdata [get_bd_pins video_frame_crc/vid_out_axis_tdata] [get_bd_pins slice_crc/Din]
connect_bd_net -net net_video_frame_crc_vid_out_axis_tlast [get_bd_pins video_frame_crc/vid_out_axis_tlast] [get_bd_pins v_hdmi_tx_ss/VIDEO_IN_tlast]
connect_bd_net -net net_video_frame_crc_vid_out_axis_tready [get_bd_pins v_hdmi_tx_ss/VIDEO_IN_tready] \
  [get_bd_pins video_frame_crc/vid_out_axis_tready]
connect_bd_net -net net_video_frame_crc_vid_out_axis_tuser [get_bd_pins video_frame_crc/vid_out_axis_tuser] [get_bd_pins v_hdmi_tx_ss/VIDEO_IN_tuser]
connect_bd_net -net net_video_frame_crc_vid_out_axis_tvalid [get_bd_pins video_frame_crc/vid_out_axis_tvalid] \
  [get_bd_pins v_hdmi_tx_ss/VIDEO_IN_tvalid]
connect_bd_net -net net_zynq_us_ss_0_clk_out2 [get_bd_pins zynq_us_ss_0/clk_out2] \
  [get_bd_pins v_tpg_ss_0/ap_clk] [get_bd_pins tx_video_axis_reg_slice/aclk] [get_bd_pins v_hdmi_tx_ss/s_axis_video_aclk] \
  [get_bd_pins video_frame_crc/vid_in_axis_aclk] [get_bd_pins video_gen/s_axis_s2mm_aclk]
connect_bd_net -net net_zynq_us_ss_0_dcm_locked [get_bd_pins zynq_us_ss_0/dcm_locked] \
  [get_bd_pins v_tpg_ss_0/m_axi_aresetn] [get_bd_pins tx_video_axis_reg_slice/aresetn] \
  [get_bd_pins v_hdmi_tx_ss/s_axis_video_aresetn] [get_bd_pins video_frame_crc/vid_in_axis_aresetn]
connect_bd_net -net net_zynq_us_ss_0_peripheral_aresetn [get_bd_pins zynq_us_ss_0/peripheral_aresetn] \
  [get_bd_pins vid_phy_controller/vid_phy_sb_aresetn] [get_bd_pins vid_phy_controller/vid_phy_axi4lite_aresetn] \
  [get_bd_pins audio_ss_0/ARESETN] [get_bd_pins v_hdmi_tx_ss/s_axi_cpu_aresetn] [get_bd_pins video_frame_crc/s_axi_aresetn] \
  [get_bd_pins video_gen/axi_resetn]
connect_bd_net -net net_zynq_us_ss_0_s_axi_aclk [get_bd_pins zynq_us_ss_0/s_axi_aclk] \
  [get_bd_pins vid_phy_controller/vid_phy_sb_aclk] [get_bd_pins vid_phy_controller/vid_phy_axi4lite_aclk] \
  [get_bd_pins audio_ss_0/ACLK] [get_bd_pins v_hdmi_tx_ss/s_axi_cpu_aclk] [get_bd_pins vid_phy_controller/drpclk] \
  [get_bd_pins video_frame_crc/s_axi_aclk] [get_bd_pins video_gen/s_axi_lite_aclk]
connect_bd_net -net proc_sys_reset_0_peripheral_aresetn [get_bd_pins video_gen/c0_ddr4_aresetn] [get_bd_pins system_ila_0/resetn]
connect_bd_net -net reset_0_1 [get_bd_ports usr_rst] [get_bd_pins zynq_us_ss_0/usr_rst]

# ---- address map ----
assign_bd_address -offset 0x00000000 -range 2G -target_address_space [get_bd_addr_spaces video_gen/axi_vdma_0/Data_MM2S] [get_bd_addr_segs zynq_us_ss_0/zynq_us/SAXIGP2/HP0_DDR_LOW]
assign_bd_address -offset 0xC0000000 -range 512M -target_address_space [get_bd_addr_spaces video_gen/axi_vdma_0/Data_MM2S] [get_bd_addr_segs zynq_us_ss_0/zynq_us/SAXIGP2/HP0_QSPI]
exclude_bd_addr_seg -offset 0xFF000000 -range 16M -target_address_space [get_bd_addr_spaces video_gen/axi_vdma_0/Data_MM2S] [get_bd_addr_segs zynq_us_ss_0/zynq_us/SAXIGP2/HP0_LPS_OCM]
assign_bd_address -offset 0x00000000 -range 2G -target_address_space [get_bd_addr_spaces video_gen/axi_vdma_0/Data_S2MM] [get_bd_addr_segs zynq_us_ss_0/zynq_us/SAXIGP2/HP0_DDR_LOW]
assign_bd_address -offset 0xC0000000 -range 512M -target_address_space [get_bd_addr_spaces video_gen/axi_vdma_0/Data_S2MM] [get_bd_addr_segs zynq_us_ss_0/zynq_us/SAXIGP2/HP0_QSPI]
exclude_bd_addr_seg -offset 0xFF000000 -range 16M -target_address_space [get_bd_addr_spaces video_gen/axi_vdma_0/Data_S2MM] [get_bd_addr_segs zynq_us_ss_0/zynq_us/SAXIGP2/HP0_LPS_OCM]
assign_bd_address -offset 0x0080000000 -range 64K -target_address_space [get_bd_addr_spaces zynq_us_ss_0/zynq_us/Data] [get_bd_addr_segs audio_ss_0/aud_pat_gen/axi/reg0]
assign_bd_address -offset 0x0080010000 -range 64K -target_address_space [get_bd_addr_spaces zynq_us_ss_0/zynq_us/Data] [get_bd_addr_segs audio_ss_0/clk_wiz/s_axi_lite/Reg]
assign_bd_address -offset 0x0080020000 -range 64K -target_address_space [get_bd_addr_spaces zynq_us_ss_0/zynq_us/Data] [get_bd_addr_segs audio_ss_0/hdmi_acr_ctrl/axi/Reg]
assign_bd_address -offset 0x0080030000 -range 64K -target_address_space [get_bd_addr_spaces zynq_us_ss_0/zynq_us/Data] [get_bd_addr_segs v_tpg_ss_0/axi_gpio/S_AXI/Reg]
assign_bd_address -offset 0x0080040000 -range 128K -target_address_space [get_bd_addr_spaces zynq_us_ss_0/zynq_us/Data] [get_bd_addr_segs v_hdmi_tx_ss/S_AXI_CPU_IN/Reg]
assign_bd_address -offset 0x0080060000 -range 64K -target_address_space [get_bd_addr_spaces zynq_us_ss_0/zynq_us/Data] [get_bd_addr_segs v_tpg_ss_0/v_tpg/s_axi_CTRL/Reg]
assign_bd_address -offset 0x0080070000 -range 64K -target_address_space [get_bd_addr_spaces zynq_us_ss_0/zynq_us/Data] [get_bd_addr_segs vid_phy_controller/vid_phy_axi4lite/Reg]
assign_bd_address -offset 0x0080080000 -range 64K -target_address_space [get_bd_addr_spaces zynq_us_ss_0/zynq_us/Data] [get_bd_addr_segs video_frame_crc/S_AXI/Reg]
assign_bd_address -offset 0x0080090000 -range 64K -target_address_space [get_bd_addr_spaces zynq_us_ss_0/zynq_us/Data] [get_bd_addr_segs zynq_us_ss_0/fmch_axi_iic/S_AXI/Reg]
assign_bd_address -offset 0x00800A0000 -range 64K -target_address_space [get_bd_addr_spaces zynq_us_ss_0/zynq_us/Data] [get_bd_addr_segs video_gen/axi_vdma_0/S_AXI_LITE/Reg]

validate_bd_design
save_bd_design
